# Altium schematic sheet MCU_CCU_HAS.SchDoc
size A
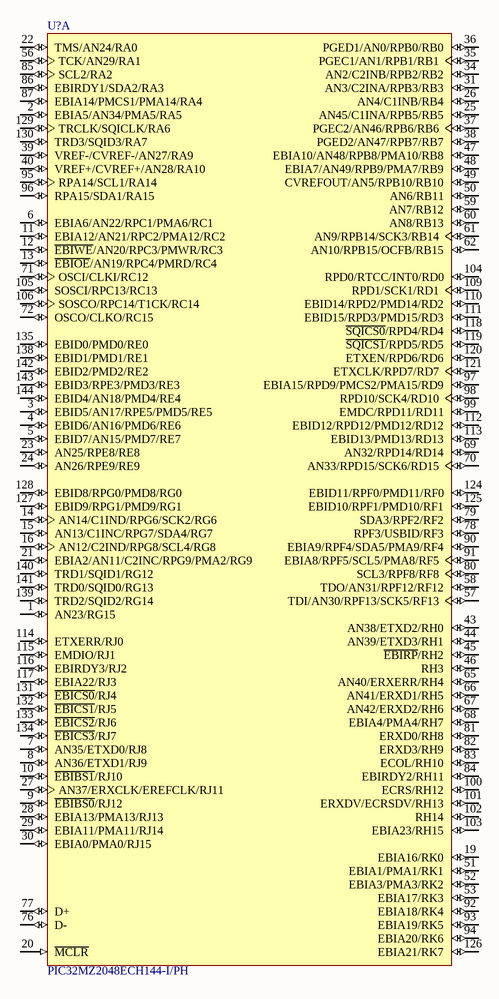
[diagram p0: MCU_CCU_HAS.SchDoc]

## Parts
U?  PIC32MZ2048ECH144-I/PH  [MCHP-TQFP-PH144_M]  (part A of 2)

## Nets

Not connected (* = marked no-connect by the designer): U? 1(AN23/RG15) 2(EBIA5/AN34/PMA5/RA5) 3(EBID5/AN17/RPE5/PMD5/RE5) 4(EBID6/AN16/PMD6/RE6) 5(EBID7/AN15/PMD7/RE7) 6(EBIA6/AN22/RPC1/PMA6/RC1) 7(AN35/ETXD0/RJ8) 8(AN36/ETXD1/RJ9) 9(~{EBIBS0}/RJ12) 10(~{EBIBS1}/RJ10) 11(EBIA12/AN21/RPC2/PMA12/RC2) 12(~{EBIWE}/AN20/RPC3/PMWR/RC3) 13(~{EBIOE}/AN19/RPC4/PMRD/RC4) 14(AN14/C1IND/RPG6/SCK2/RG6) 15(AN13/C1INC/RPG7/SDA4/RG7) 16(AN12/C2IND/RPG8/SCL4/RG8) 19(EBIA16/RK0) 20(~{MCLR}) 21(EBIA2/AN11/C2INC/RPG9/PMA2/RG9) 22(TMS/AN24/RA0) 23(AN25/RPE8/RE8) 24(AN26/RPE9/RE9) 25(AN45/C1INA/RPB5/RB5) 26(AN4/C1INB/RB4) 27(AN37/ERXCLK/EREFCLK/RJ11) 28(EBIA13/PMA13/RJ13) 29(EBIA11/PMA11/RJ14) 30(EBIA0/PMA0/RJ15) 31(AN3/C2INA/RPB3/RB3) 34(AN2/C2INB/RPB2/RB2) 35(PGEC1/AN1/RPB1/RB1) 36(PGED1/AN0/RPB0/RB0) 37(PGEC2/AN46/RPB6/RB6) 38(PGED2/AN47/RPB7/RB7) 39(VREF-/CVREF-/AN27/RA9) 40(VREF+/CVREF+/AN28/RA10) 43(AN38/ETXD2/RH0) 44(AN39/ETXD3/RH1) 45(~{EBIRP}/RH2) 46(RH3) 47(EBIA10/AN48/RPB8/PMA10/RB8) 48(EBIA7/AN49/RPB9/PMA7/RB9) 49(CVREFOUT/AN5/RPB10/RB10) 50(AN6/RB11) 51(EBIA1/PMA1/RK1) 52(EBIA3/PMA3/RK2) 53(EBIA17/RK3) 56(TCK/AN29/RA1) 57(TDI/AN30/RPF13/SCK5/RF13) 58(TDO/AN31/RPF12/RF12) 59(AN7/RB12) 60(AN8/RB13) 61(AN9/RPB14/SCK3/RB14) 62(AN10/RPB15/OCFB/RB15) 65(AN40/ERXERR/RH4) 66(AN41/ERXD1/RH5) 67(AN42/ERXD2/RH6) 68(EBIA4/PMA4/RH7) 69(AN32/RPD14/RD14) 70(AN33/RPD15/SCK6/RD15) 71(OSCI/CLKI/RC12) 72(OSCO/CLKO/RC15) 76(D-) 77(D+) 78(RPF3/USBID/RF3) 79(SDA3/RPF2/RF2) 80(SCL3/RPF8/RF8) 81(ERXD0/RH8) 82(ERXD3/RH9) 83(ECOL/RH10) 84(EBIRDY2/RH11) 85(SCL2/RA2) 86(EBIRDY1/SDA2/RA3) 87(EBIA14/PMCS1/PMA14/RA4) 90(EBIA9/RPF4/SDA5/PMA9/RF4) 91(EBIA8/RPF5/SCL5/PMA8/RF5) 92(EBIA18/RK4) 93(EBIA19/RK5) 94(EBIA20/RK6) 95(RPA14/SCL1/RA14) 96(RPA15/SDA1/RA15) 97(EBIA15/RPD9/PMCS2/PMA15/RD9) 98(RPD10/SCK4/RD10) 99(EMDC/RPD11/RD11) 100(ECRS/RH12) 101(ERXDV/ECRSDV/RH13) 102(RH14) 103(EBIA23/RH15) 104(RPD0/RTCC/INT0/RD0) 105(SOSCI/RPC13/RC13) 106(SOSCO/RPC14/T1CK/RC14) 109(RPD1/SCK1/RD1) 110(EBID14/RPD2/PMD14/RD2) 111(EBID15/RPD3/PMD15/RD3) 112(EBID12/RPD12/PMD12/RD12) 113(EBID13/PMD13/RD13) 114(ETXERR/RJ0) 115(EMDIO/RJ1) 116(EBIRDY3/RJ2) 117(EBIA22/RJ3) 118(~{SQICS0}/RPD4/RD4) 119(~{SQICS1}/RPD5/RD5) 120(ETXEN/RPD6/RD6) 121(ETXCLK/RPD7/RD7) 124(EBID11/RPF0/PMD11/RF0) 125(EBID10/RPF1/PMD10/RF1) 126(EBIA21/RK7) 127(EBID9/RPG1/PMD9/RG1) 128(EBID8/RPG0/PMD8/RG0) 129(TRCLK/SQICLK/RA6) 130(TRD3/SQID3/RA7) 131(~{EBICS0}/RJ4) 132(~{EBICS1}/RJ5) 133(~{EBICS2}/RJ6) 134(~{EBICS3}/RJ7) 135(EBID0/PMD0/RE0) 138(EBID1/PMD1/RE1) 139(TRD2/SQID2/RG14) 140(TRD1/SQID1/RG12) 141(TRD0/SQID0/RG13) 142(EBID2/PMD2/RE2) 143(EBID3/RPE3/PMD3/RE3) 144(EBID4/AN18/PMD4/RE4)

## Library data of the parts
U? = CMP-0889-00079-1: 32-Bit Microcontroller with Audio and Graphics Interfaces, HS USB, Ethernet, and Advanced Analog, 2048 KB Program Memory, 120 I/O Pins, PMP, Industrial Temperature, 144-Pin TQFP (PH144), Tray; Manufacturer: Microchip; VCC Range: 2.2 to 3.6 V; Packing: Tray; DatasheetVersion: Rev. B; PackageVersion: C04-155B, 12/2012; ComponentLink3Description: Package Specification; Mounting Technology: Surface Mount; ComponentLink1Description: Manufacturer URL; PackageReference: TQFP-PH144; ComponentLink1URL: http://www.microchip.com/; ComponentLink2URL: http://ww1.microchip.com/downloads/en/DeviceDoc/60001191B.pdf; PackageDescription: 144-Lead Plastic Thin Quad Flatpack, 16 x 16 mm Body, 0.4 mm Pitch; PartNumber: PIC32MZ2048ECH144-I/PH; ComponentLink3URL: http://www.microchip.com/stellent/groups/techpub_sg/documents/packagingspec/en012702.pdf; ComponentLink2Description: Datasheet